# Altium schematic sheet sch_cm4_rs485.SchDoc
size A4; SheetNumber: 5; SheetTotal: 7
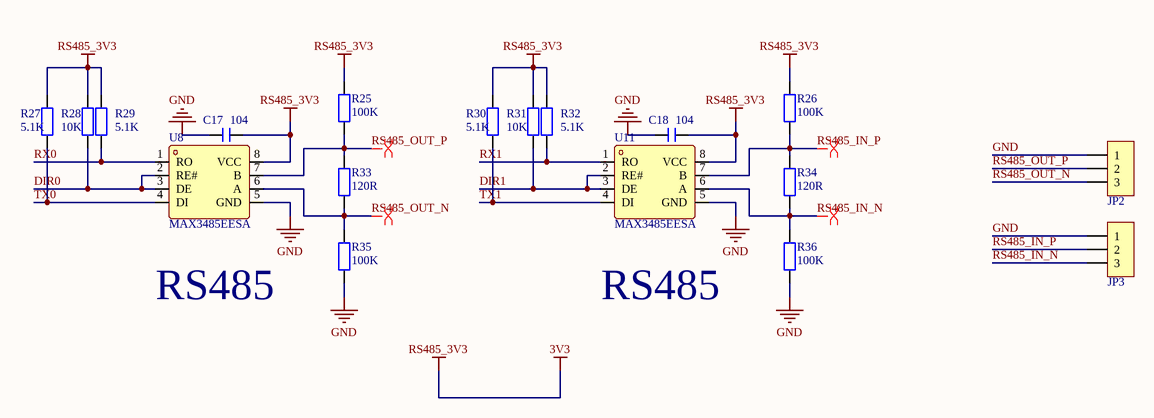
[diagram p0: sch_cm4_rs485.SchDoc]

## Parts
C17  104  [C 0805_L]
C18  104  [C 0805_L]
JP2  HDR-1X3  [KF128-3.81-3P]  (value not drawn)
JP3  HDR-1X3  [KF128-3.81-3P]  (value not drawn)
R25  100K  [R 0805_L]
R26  100K  [R 0805_L]
R27  5.1K  [R 0805_L]
R28  10K  [R 0805_L]
R29  5.1K  [R 0805_L]
R30  5.1K  [R 0805_L]
R31  10K  [R 0805_L]
R32  5.1K  [R 0805_L]
R33  120R  [R 0603_L]
R34  120R  [R 0603_L]
R35  100K  [R 0805_L]
R36  100K  [R 0805_L]
U8  MAX3485EESA  [MAX3485EESA]
U11  MAX3485EESA  [MAX3485EESA]

## Nets
3V3: C17.1 C18.1 R25.1 R26.1 R27.2 R28.2 R29.2 R30.2 R31.2 R32.2 U8.8(VCC) U11.8(VCC)  [also labelled RS485_3V3]
GND: C17.2 C18.2 JP2.1 JP3.1 R35.2 R36.2 U8.5(GND) U11.5(GND)
DIR0: R28.1 U8.2(RE#) U8.3(DE)
DIR1: R31.1 U11.2(RE#) U11.3(DE)
RS485_IN_N: JP3.3 R34.2 R36.1 U11.6(A)
RS485_IN_P: JP3.2 R26.2 R34.1 U11.7(B)
RS485_OUT_N: JP2.3 R33.2 R35.1 U8.6(A)
RS485_OUT_P: JP2.2 R25.2 R33.1 U8.7(B)
RX0: R29.1 U8.1(RO)
RX1: R32.1 U11.1(RO)
TX0: R27.1 U8.4(DI)
TX1: R30.1 U11.4(DI)

## Layout directives
differential pair: RS485_IN_N, RS485_IN_P, RS485_OUT_N, RS485_OUT_P

## Notes on the sheet
- RS485

## Library data of the parts
C17 C18 = C: 贴片电容; BOM名称: 无极性贴片电容; 淘宝ID: 封装库来自淘宝 ID：黄晶宝石; 联系售后，技术支持: https://shop463601444.taobao.com; 唯一出售店铺网址: https://shop463601444.taobao.com
JP2 JP3 = Header 3: 3P接插件; 版权归属: 封装库来自淘宝 ID：黄晶宝石; BOM名称: 3P接插件; 学习资源: https://shop463601444.taobao.com
R25-R36 = R: 贴片电阻; 版权归属: 来自淘宝 ID：黄晶宝石; 封装库来自淘宝卖家 ID：黄晶宝石: 其他店铺购入均为盗版，不享受售后技术支持服务，请立即申请退款; BOM名称: 贴片电阻; 联系售后: https://item.taobao.com/item.htm?id=566775463719